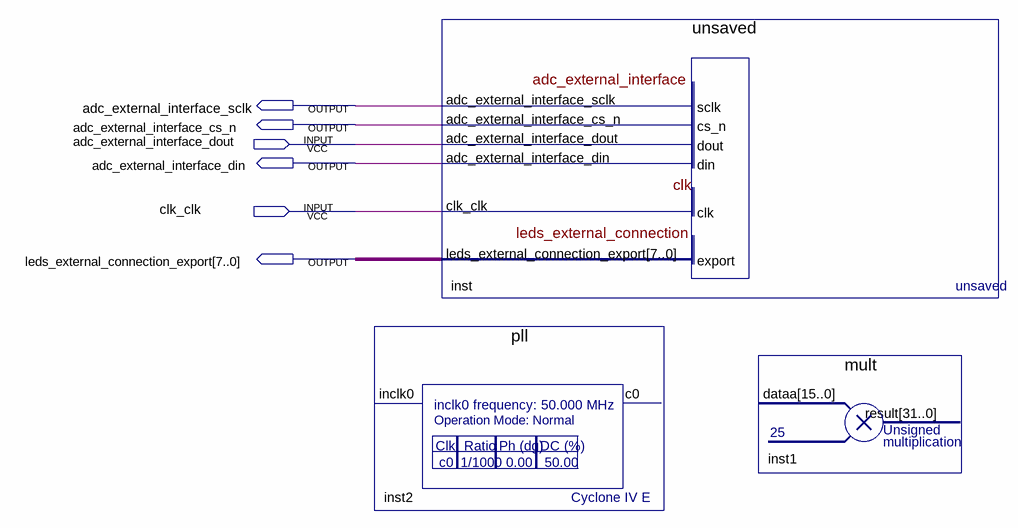
[diagram p0: schematic sheet]
// Quartus schematic adc.bdf as structural Verilog: 3 symbols, 6 pins
module adc (
  input  adc_external_interface_dout,
  input  clk_clk,
  output adc_external_interface_sclk,
  output adc_external_interface_cs_n,
  output adc_external_interface_din,
  output [7:0] leds_external_connection_export
);

  pll inst2 ();  // open: inclk0, c0
  unsaved inst (
    .adc_external_interface_dout(adc_external_interface_dout), .clk_clk(clk_clk),
    .adc_external_interface_sclk(adc_external_interface_sclk),
    .adc_external_interface_cs_n(adc_external_interface_cs_n),
    .adc_external_interface_din(adc_external_interface_din),
    .leds_external_connection_export(leds_external_connection_export));
  mult inst1 ();  // open: dataa, result
endmodule
